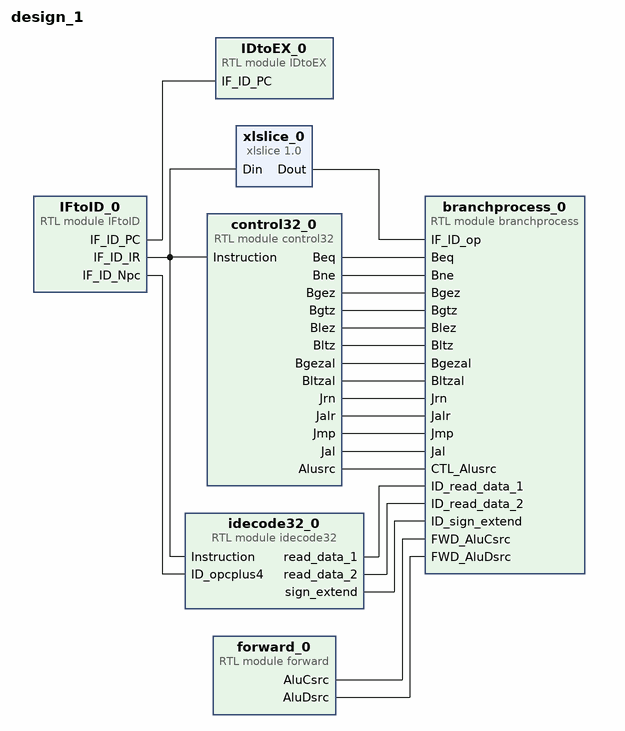
[diagram p0: block diagram of the top level]
# Vivado block design design_1, xc7a100tfgg484-1, Vivado 2017.4
create_bd_design design_1

create_bd_cell -type module -reference control32 control32_0
create_bd_cell -type module -reference IFtoID IFtoID_0
create_bd_cell -type module -reference idecode32 idecode32_0
create_bd_cell -type module -reference branchprocess branchprocess_0
create_bd_cell -type module -reference IDtoEX IDtoEX_0
create_bd_cell -type ip -vlnv xilinx.com:ip:xlslice:1.0 xlslice_0
set_property -dict {CONFIG.DIN_TO 26 CONFIG.DIN_FROM 31 CONFIG.DOUT_WIDTH 6} [get_bd_cells xlslice_0]
create_bd_cell -type module -reference forward forward_0

# ---- connections ----

connect_bd_net [get_bd_pins IFtoID_0/IF_ID_Npc] [get_bd_pins idecode32_0/ID_opcplus4]
connect_bd_net [get_bd_pins IFtoID_0/IF_ID_PC] [get_bd_pins IDtoEX_0/IF_ID_PC]
connect_bd_net [get_bd_pins IFtoID_0/IF_ID_IR] [get_bd_pins idecode32_0/Instruction] [get_bd_pins xlslice_0/Din] [get_bd_pins control32_0/Instruction]
connect_bd_net [get_bd_pins xlslice_0/Dout] [get_bd_pins branchprocess_0/IF_ID_op]
connect_bd_net [get_bd_pins control32_0/Beq] [get_bd_pins branchprocess_0/Beq]
connect_bd_net [get_bd_pins control32_0/Bne] [get_bd_pins branchprocess_0/Bne]
connect_bd_net [get_bd_pins control32_0/Bgez] [get_bd_pins branchprocess_0/Bgez]
connect_bd_net [get_bd_pins control32_0/Bgtz] [get_bd_pins branchprocess_0/Bgtz]
connect_bd_net [get_bd_pins control32_0/Blez] [get_bd_pins branchprocess_0/Blez]
connect_bd_net [get_bd_pins control32_0/Bltz] [get_bd_pins branchprocess_0/Bltz]
connect_bd_net [get_bd_pins control32_0/Bgezal] [get_bd_pins branchprocess_0/Bgezal]
connect_bd_net [get_bd_pins control32_0/Bltzal] [get_bd_pins branchprocess_0/Bltzal]
connect_bd_net [get_bd_pins control32_0/Jrn] [get_bd_pins branchprocess_0/Jrn]
connect_bd_net [get_bd_pins control32_0/Jalr] [get_bd_pins branchprocess_0/Jalr]
connect_bd_net [get_bd_pins control32_0/Jmp] [get_bd_pins branchprocess_0/Jmp]
connect_bd_net [get_bd_pins control32_0/Jal] [get_bd_pins branchprocess_0/Jal]
connect_bd_net [get_bd_pins control32_0/Alusrc] [get_bd_pins branchprocess_0/CTL_Alusrc]
connect_bd_net [get_bd_pins idecode32_0/read_data_1] [get_bd_pins branchprocess_0/ID_read_data_1]
connect_bd_net [get_bd_pins idecode32_0/read_data_2] [get_bd_pins branchprocess_0/ID_read_data_2]
connect_bd_net [get_bd_pins idecode32_0/sign_extend] [get_bd_pins branchprocess_0/ID_sign_extend]
connect_bd_net [get_bd_pins forward_0/AluCsrc] [get_bd_pins branchprocess_0/FWD_AluCsrc]
connect_bd_net [get_bd_pins forward_0/AluDsrc] [get_bd_pins branchprocess_0/FWD_AluDsrc]

validate_bd_design
save_bd_design
